# Altium schematic sheet Sheet1.SchDoc
size A4; Engineer: Carolyn Sun
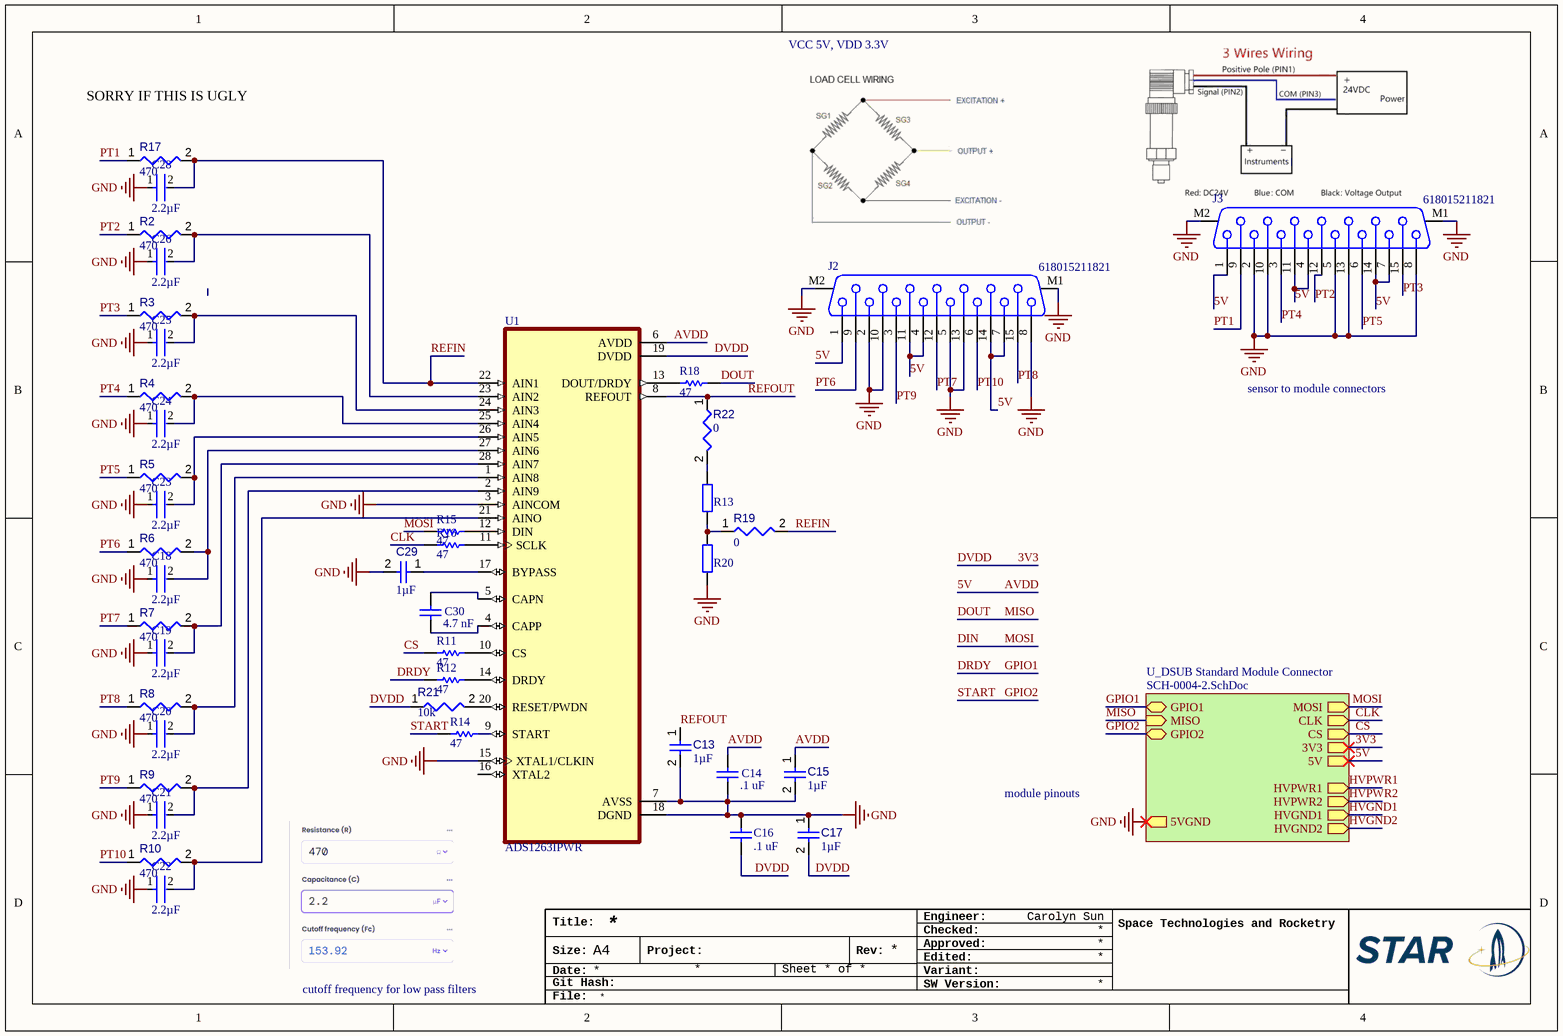
[diagram p0: Sheet1.SchDoc]

## Parts
C13  value 1µF  [CAPC1608X94X35NL15T15]  (hidden comment: Capacitor 1 uF +/- 10% 16 V 0603)
C14  .1 uF  [CAPC1608X90X35ML10T15]
C15  value 1µF  [CAPC1608X94X35NL15T15]  (hidden comment: Capacitor 1 uF +/- 10% 16 V 0603)
C16  .1 uF  [CAPC1608X90X35ML10T15]
C17  value 1µF  [CAPC1608X94X35NL15T15]  (hidden comment: Capacitor 1 uF +/- 10% 16 V 0603)
C18  value 2.2µF  [FP-CL21-IPC_B]  (hidden comment: CL21B225KPFNNNE)
C19  value 2.2µF  [FP-CL21-IPC_B]  (hidden comment: CL21B225KPFNNNE)
C20  value 2.2µF  [FP-CL21-IPC_B]  (hidden comment: CL21B225KPFNNNE)
C21  value 2.2µF  [FP-CL21-IPC_B]  (hidden comment: CL21B225KPFNNNE)
C22  value 2.2µF  [FP-CL21-IPC_B]  (hidden comment: CL21B225KPFNNNE)
C23  value 2.2µF  [FP-CL21-IPC_B]  (hidden comment: CL21B225KPFNNNE)
C24  value 2.2µF  [FP-CL21-IPC_B]  (hidden comment: CL21B225KPFNNNE)
C25  value 2.2µF  [FP-CL21-IPC_B]  (hidden comment: CL21B225KPFNNNE)
C26  value 2.2µF  [FP-CL21-IPC_B]  (hidden comment: CL21B225KPFNNNE)
C28  value 2.2µF  [FP-CL21-IPC_B]  (hidden comment: CL21B225KPFNNNE)
C29  value 1µF  [CAPC1608X94X35NL15T15]  (hidden comment: Capacitor 1 uF +/- 10% 16 V 0603)
C30  4.7 nF  [CAPC1608X90X35ML10T15]
J2  618015211821  [618015211821]
J3  618015211821  [618015211821]
R2  value 470  [RESC0805(2012)_L]  (hidden comment: 470R5J)
R3  value 470  [RESC0805(2012)_L]  (hidden comment: 470R5J)
R4  value 470  [RESC0805(2012)_L]  (hidden comment: 470R5J)
R5  value 470  [RESC0805(2012)_L]  (hidden comment: 470R5J)
R6  value 470  [RESC0805(2012)_L]  (hidden comment: 470R5J)
R7  value 470  [RESC0805(2012)_L]  (hidden comment: 470R5J)
R8  value 470  [RESC0805(2012)_L]  (hidden comment: 470R5J)
R9  value 470  [RESC0805(2012)_L]  (hidden comment: 470R5J)
R10  value 470  [RESC0805(2012)_L]  (hidden comment: 470R5J)
R11  47  [RESC1609X50X30LL10T20]
R12  47  [RESC1609X50X30LL10T20]
R13  RES_0603  [RES_0603]  (value not drawn)
R14  47  [RESC1609X50X30LL10T20]
R15  47  [RESC1609X50X30LL10T20]
R16  47  [RESC1609X50X30LL10T20]
R17  value 470  [RESC0805(2012)_L]  (hidden comment: 470R5J)
R18  47  [RESC1609X50X30LL10T20]
R19  value 0  [RESC0603(1608)_L]  (hidden comment: Jumper 0603)
R20  RES_0603  [RES_0603]  (value not drawn)
R21  value 10k  [RESC1608X55X25ML10T15]  (hidden comment: Resistor 10k +/-1% 0603 100 mW)
R22  value 0  [RESC0603(1608)_L]  (hidden comment: Jumper 0603)
U1  ADS1263IPWR  [SOP65P640X120-28N]

## Sub-sheets
U_DSUB Standard Module Connector = SCH-0004-2.SchDoc: GPIO1 (bidir), MISO (in), MOSI (out), CLK (out), CS (out), GPIO2 (bidir), 3V3 (out), 5V (out), 5VGND (out), HVPWR1 (out), HVPWR2 (out), HVGND1 (out), HVGND2 (out)

## Nets
GND: C13.2 C14.1 C15.2 C16.2 C17.1 C18.1 C19.1 C20.1 C21.1 C22.1 C23.1 C24.1 C25.1 C26.1 C28.1 C29.2 J2.2 J2.5 J2.8 J2.10 J2.13 J2.M1 J2.M2 J3.2 J3.5 J3.8 J3.10 J3.13 J3.M1 J3.M2 R20.2 U1.3(AINCOM) U1.7(AVSS) U1.15(XTAL1/CLKIN) U1.18(DGND) ; sheet U_DSUB Standard Module Connector/5VGND
3V3: C16.1 C17.2 R21.1 U1.19(DVDD) ; sheet U_DSUB Standard Module Connector/3V3  [also labelled DVDD]
5V: C14.2 C15.1 J2.1 J2.4 J2.7 J2.11 J2.14 J3.1 J3.4 J3.7 J3.11 J3.14 U1.6(AVDD) ; sheet U_DSUB Standard Module Connector/5V  [also labelled AVDD]
CLK: R16.1 ; sheet U_DSUB Standard Module Connector/CLK
CS: R11.1 ; sheet U_DSUB Standard Module Connector/CS
DIN: R15.1 ; sheet U_DSUB Standard Module Connector/MOSI  [also labelled MOSI]
DOUT: R18.2 ; sheet U_DSUB Standard Module Connector/MISO  [also labelled MISO]
DRDY: R12.1 ; sheet U_DSUB Standard Module Connector/GPIO1  [also labelled GPIO1]
GPIO2: R14.1 ; sheet U_DSUB Standard Module Connector/GPIO2  [also labelled START]
HVGND1: sheet U_DSUB Standard Module Connector/HVGND1
HVGND2: sheet U_DSUB Standard Module Connector/HVGND2
HVPWR1: sheet U_DSUB Standard Module Connector/HVPWR1
HVPWR2: sheet U_DSUB Standard Module Connector/HVPWR2
PT1: J3.9 R17.1
PT2: J3.12 R2.1
PT3: J3.15 R3.1
PT4: J3.3 R4.1
PT5: J3.6 R5.1
PT6: J2.9 R6.1
PT7: J2.12 R7.1
PT8: J2.15 R8.1
PT9: J2.3 R9.1
PT10: J2.6 R10.1
REFIN: C28.2 R17.2 R19.2 U1.22(AIN1)
REFOUT: C13.1 R22.1 U1.8(REFOUT)
NetC18_2: C18.2 R6.2 U1.27(AIN6)
NetC19_2: C19.2 R7.2 U1.28(AIN7)
NetC20_2: C20.2 R8.2 U1.1(AIN8)
NetC21_2: C21.2 R9.2 U1.2(AIN9)
NetC22_2: C22.2 R10.2 U1.21(AINO)
NetC23_2: C23.2 R5.2 U1.26(AIN5)
NetC24_2: C24.2 R4.2 U1.25(AIN4)
NetC25_2: C25.2 R3.2 U1.24(AIN3)
NetC26_2: C26.2 R2.2 U1.23(AIN2)
NetC29_1: C29.1 U1.17(BYPASS)
NetC30_1: C30.1 U1.4(CAPP)
NetC30_2: C30.2 U1.5(CAPN)
NetR11_2: R11.2 U1.10(CS)
NetR12_2: R12.2 U1.14(DRDY)
NetR13_1: R13.1 R22.2
NetR13_2: R13.2 R19.1 R20.1
NetR14_2: R14.2 U1.9(START)
NetR15_2: R15.2 U1.12(DIN)
NetR16_2: R16.2 U1.11(SCLK)
NetR18_1: R18.1 U1.13(DOUT/DRDY)
NetR21_2: R21.2 U1.20(RESET/PWDN)

Not connected (* = marked no-connect by the designer): U1 16(XTAL2)

## Notes on the sheet
- SORRY IF THIS IS UGLY
- VCC 5V, VDD 3.3V
- Type @ to refer to a designator
- sensor to module connectors
- module pinouts
- cutoff frequency for low pass filters
- Title:
- Engineer:
- Checked:
- Space Technologies and Rocketry
- Size:
- Date:
- Git Hash:
- A4
- Project:
- Rev:
- SW Version:
- Variant:
- Edited:
- Approved:
- File:

## Library data of the parts
C13 C15 C17 C29 = CMP-001-00003-6: Chip Capacitor, 1 uF, +/- 10%, 16 V, 0603 (1608 Metric); Voltage Rating: 16V; Capacitor Type: Ceramic; Max Operating Temperature: 125°C; Pins: 2; Tolerance: 10%; Min Operating Temperature: -55°C; RoHS Compliant: True; Mounting Technology: SM; Case/Package: 0603
C14 C16 = CMP-2100-03643-1: Chip Capacitor, 0.1 uF, +/- 10%, 50 V, -55 to 125 degC, 0603 (1608 Metric), RoHS, Tape and Reel; Manufacturer: Murata; Dielectric Material: Ceramic; Voltage Rating: 50V; Capacitance: 100nF; Dielectric: X7R; Insulation Resistance: 10GR; Case Code (Metric): 1608; Lead Free: LeadFree; Depth: 0.8mm; Number of Pins: 2; Radiation Hardening: No; Case/Package: 0603; Manufacturer URL: http://www.murata.com/; Packaging: TapeandReel; Length: 1.6mm; Contact Plating: Tin; Datasheet URL: http://psearch.en.murata.com/capacitor/product/GRM188R71H104KA93%23.pdf; Tolerance: 10%; Case Code (Imperial): 0603; Min Operating Temperature: -55degC; RoHSCompliant: true; Voltage: 50V; Termination: SMD/SMT; Mount: SurfaceMount; Material: Ceramic; Package Quantity: 1; Height: 0.8mm; Thickness: 0.035inch; REACH SVHC: NoSVHC; Max Operating Temperature: 125degC; Width: 0.8mm; Package Reference: 0603; Voltage Rating (DC): 50V; Datasheet Version: 42675.0; Package Description: 2-Pin Surface Mount Device, Body 1.6 x 0.8 mm
C18-C26 C28 = CMP-001-00140-1: Ceramic Capacitor, Multilayer, Ceramic, 10V, 10% +Tol, 10% -Tol, X7R, 15% TC, 2.2uF, Surface Mount, 0805; Mounting Technology: Surface Mount; Max Operating Temperature: 125°C; Case/Package: 0805; Capacitor Type: Ceramic; Pins: 2; Min Operating Temperature: -55°C; RoHS Compliant: Yes
C30 = CMP-2006-02924-1: Part Number: GRM188R71H472KA01D; Manufacturer: Murata
J2 J3 = CMP-002-00091-1: D Type Connector, 15 Contact(s), Female, Solder Terminal, Locking, Plug; RoHS Compliant: Yes; Min Operating Temperature: -40°C; Mounting Technology: Board; Max Operating Temperature: 85°C
R2-R10 R17 = CMP-009-00102-2: 470R 0.125W 5% 0805 (2012 Metric)  SMD; Power: 125mW; Pins: 2; Case/Package: 0805; Mounting Technology: SMT; Tolerance: 5%
R11 R12 R14-R16 R18 = CMP-2000-03383-1: Manufacturer: Vishay Dale; Part Number: CRCW060347R0FKEA
R13 R20 = CMP-009-00260-1: Resistor SMD 0603; Distributor Link: *; Source: Schematic-Lib-PhilsLab.SchLib; LCSC: *; Manufacturer: *; Design Item ID: RES_0603; Manufacturer Part Number: *
R19 R22 = CMP-009-00175-3: Pins: 2; Min Operating Temperature: -55°C; Max Operating Temperature: 155°C; Case/Package: 0603
R21 = CMP-009-00017-5: Chip Resistor, 10 KOhm, +/- 1%, 01 W, -55 to 155 degC, 0603 (1608 Metric); Voltage Rating: 50V; Power: 100mW; RoHS Compliant: True; Min Operating Temperature: -55°C; Pins: 2; Case/Package: 0603; Mounting Technology: SM; Max Operating Temperature: 155°C; Tolerance: 1%
U1 = CMP-003-000000-1: 32-bit 38-kSPS 10-ch delta-sigma ADC with PGA, VREF and auxiliary ADC for factory automation; MF: Texas Instruments; Design Item ID: ADS1263IPWR; Component Type: Standard; Check_prices: https://www.snapeda.com/parts/ADS1263IPWR/Texas+Instruments/view-part/?ref=eda; Price: None; Availability: In Stock; Package: TSSOP-28 Texas Instruments; MP: ADS1263IPWR; Source: ADS1263IPWR.SchLib; SnapEDA_Link: https://www.snapeda.com/parts/ADS1263IPWR/Texas+Instruments/view-part/?ref=snap; Purchase-URL: https://pricing.snapeda.com/search/part/ADS1263IPWR/?ref=eda; Value: *; Pin Count: 28